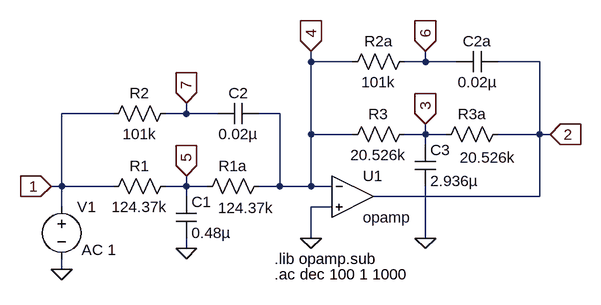
[diagram p0: schematic Linkwitz_Circuit_chk_sim.asc]
Linkwitz_Circuit_chk_sim.asc, the LTspice schematic file:
Version 4
SHEET 1 880 680
WIRE 32 32 32 16
WIRE 96 32 32 32
WIRE 208 32 208 16
WIRE 208 32 176 32
WIRE 256 32 208 32
WIRE 384 32 320 32
WIRE -272 112 -352 112
WIRE -160 112 -160 96
WIRE -160 112 -192 112
WIRE -112 112 -160 112
WIRE -16 112 -48 112
WIRE 32 144 32 32
WIRE 96 144 32 144
WIRE 208 144 208 128
WIRE 208 144 176 144
WIRE 240 144 208 144
WIRE 384 144 384 32
WIRE 384 144 320 144
WIRE 400 144 384 144
WIRE 208 160 208 144
WIRE -352 224 -352 112
WIRE -352 224 -368 224
WIRE -272 224 -352 224
WIRE -160 224 -160 208
WIRE -160 224 -192 224
WIRE -128 224 -160 224
WIRE -16 224 -16 112
WIRE -16 224 -48 224
WIRE 32 224 32 144
WIRE 32 224 -16 224
WIRE 64 224 32 224
WIRE -160 240 -160 224
WIRE 384 240 384 144
WIRE 384 240 128 240
WIRE -352 256 -352 224
WIRE 64 256 32 256
WIRE 32 304 32 256
WIRE 208 304 208 224
WIRE -160 320 -160 304
WIRE -352 352 -352 336
FLAG -352 352 0
FLAG 32 304 0
FLAG 208 304 0
FLAG -160 320 0
FLAG -368 224 1
IOPIN -368 224 In
FLAG 400 144 2
IOPIN 400 144 In
FLAG 208 128 3
IOPIN 208 128 In
FLAG 208 16 6
IOPIN 208 16 In
FLAG 32 16 4
IOPIN 32 16 In
FLAG -160 208 5
IOPIN -160 208 In
FLAG -160 96 7
IOPIN -160 96 In
SYMBOL voltage -352 240 R0
WINDOW 39 0 0 Left 0
WINDOW 3 33 83 Invisible 2
WINDOW 123 31 82 Left 2
SYMATTR Value ""
SYMATTR Value2 AC 1
SYMATTR InstName V1
SYMBOL res 192 128 R90
WINDOW 0 0 56 VBottom 2
WINDOW 3 32 56 VTop 2
SYMATTR InstName R3
SYMATTR Value 20.526k
SYMBOL res 192 16 R90
WINDOW 0 0 56 VBottom 2
WINDOW 3 32 56 VTop 2
SYMATTR InstName R2a
SYMATTR Value 101k
SYMBOL res 336 128 R90
WINDOW 0 0 56 VBottom 2
WINDOW 3 36 32 VTop 2
SYMATTR InstName R3a
SYMATTR Value 20.526k
SYMBOL res -176 96 R90
WINDOW 0 0 56 VBottom 2
WINDOW 3 32 56 VTop 2
SYMATTR InstName R2
SYMATTR Value 101k
SYMBOL res -176 208 R90
WINDOW 0 0 56 VBottom 2
WINDOW 3 32 56 VTop 2
SYMATTR InstName R1
SYMATTR Value 124.37k
SYMBOL res -32 208 R90
WINDOW 0 0 56 VBottom 2
WINDOW 3 34 36 VTop 2
SYMATTR InstName R1a
SYMATTR Value 124.37k
SYMBOL cap 192 160 R0
SYMATTR InstName C3
SYMATTR Value 2.936µ
SYMBOL cap -176 240 R0
SYMATTR InstName C1
SYMATTR Value 0.48µ
SYMBOL cap 320 16 R90
WINDOW 0 0 32 VBottom 2
WINDOW 3 32 32 VTop 2
SYMATTR InstName C2a
SYMATTR Value 0.02µ
SYMBOL cap -48 96 R90
WINDOW 0 0 32 VBottom 2
WINDOW 3 32 32 VTop 2
SYMATTR InstName C2
SYMATTR Value 0.02µ
SYMBOL OpAmps\\opamp 96 176 R0
SYMATTR InstName U1
TEXT -24 336 Left 2 !.lib opamp.sub
TEXT -24 360 Left 2 !.ac dec 100 1 1000

The netlist it stands for:
* Linkwitz_Circuit_chk_sim.asc
V1 1 0 AC 1
R3 3 4 20.526k
R2a 6 4 101k
R3a 2 3 20.526k
R2 7 1 101k
R1 5 1 124.37k
R1a 4 5 124.37k
C3 3 0 2.936µ
C1 5 0 0.48µ
C2a 2 6 0.02µ
C2 4 7 0.02µ
XU1 4 0 2 opamp Aol=100K GBW=10Meg  ; pins invin noninvin out
.lib opamp.sub
.ac dec 100 1 1000
.backanno
.end